# Altium project Volumemixer.PrjPcb
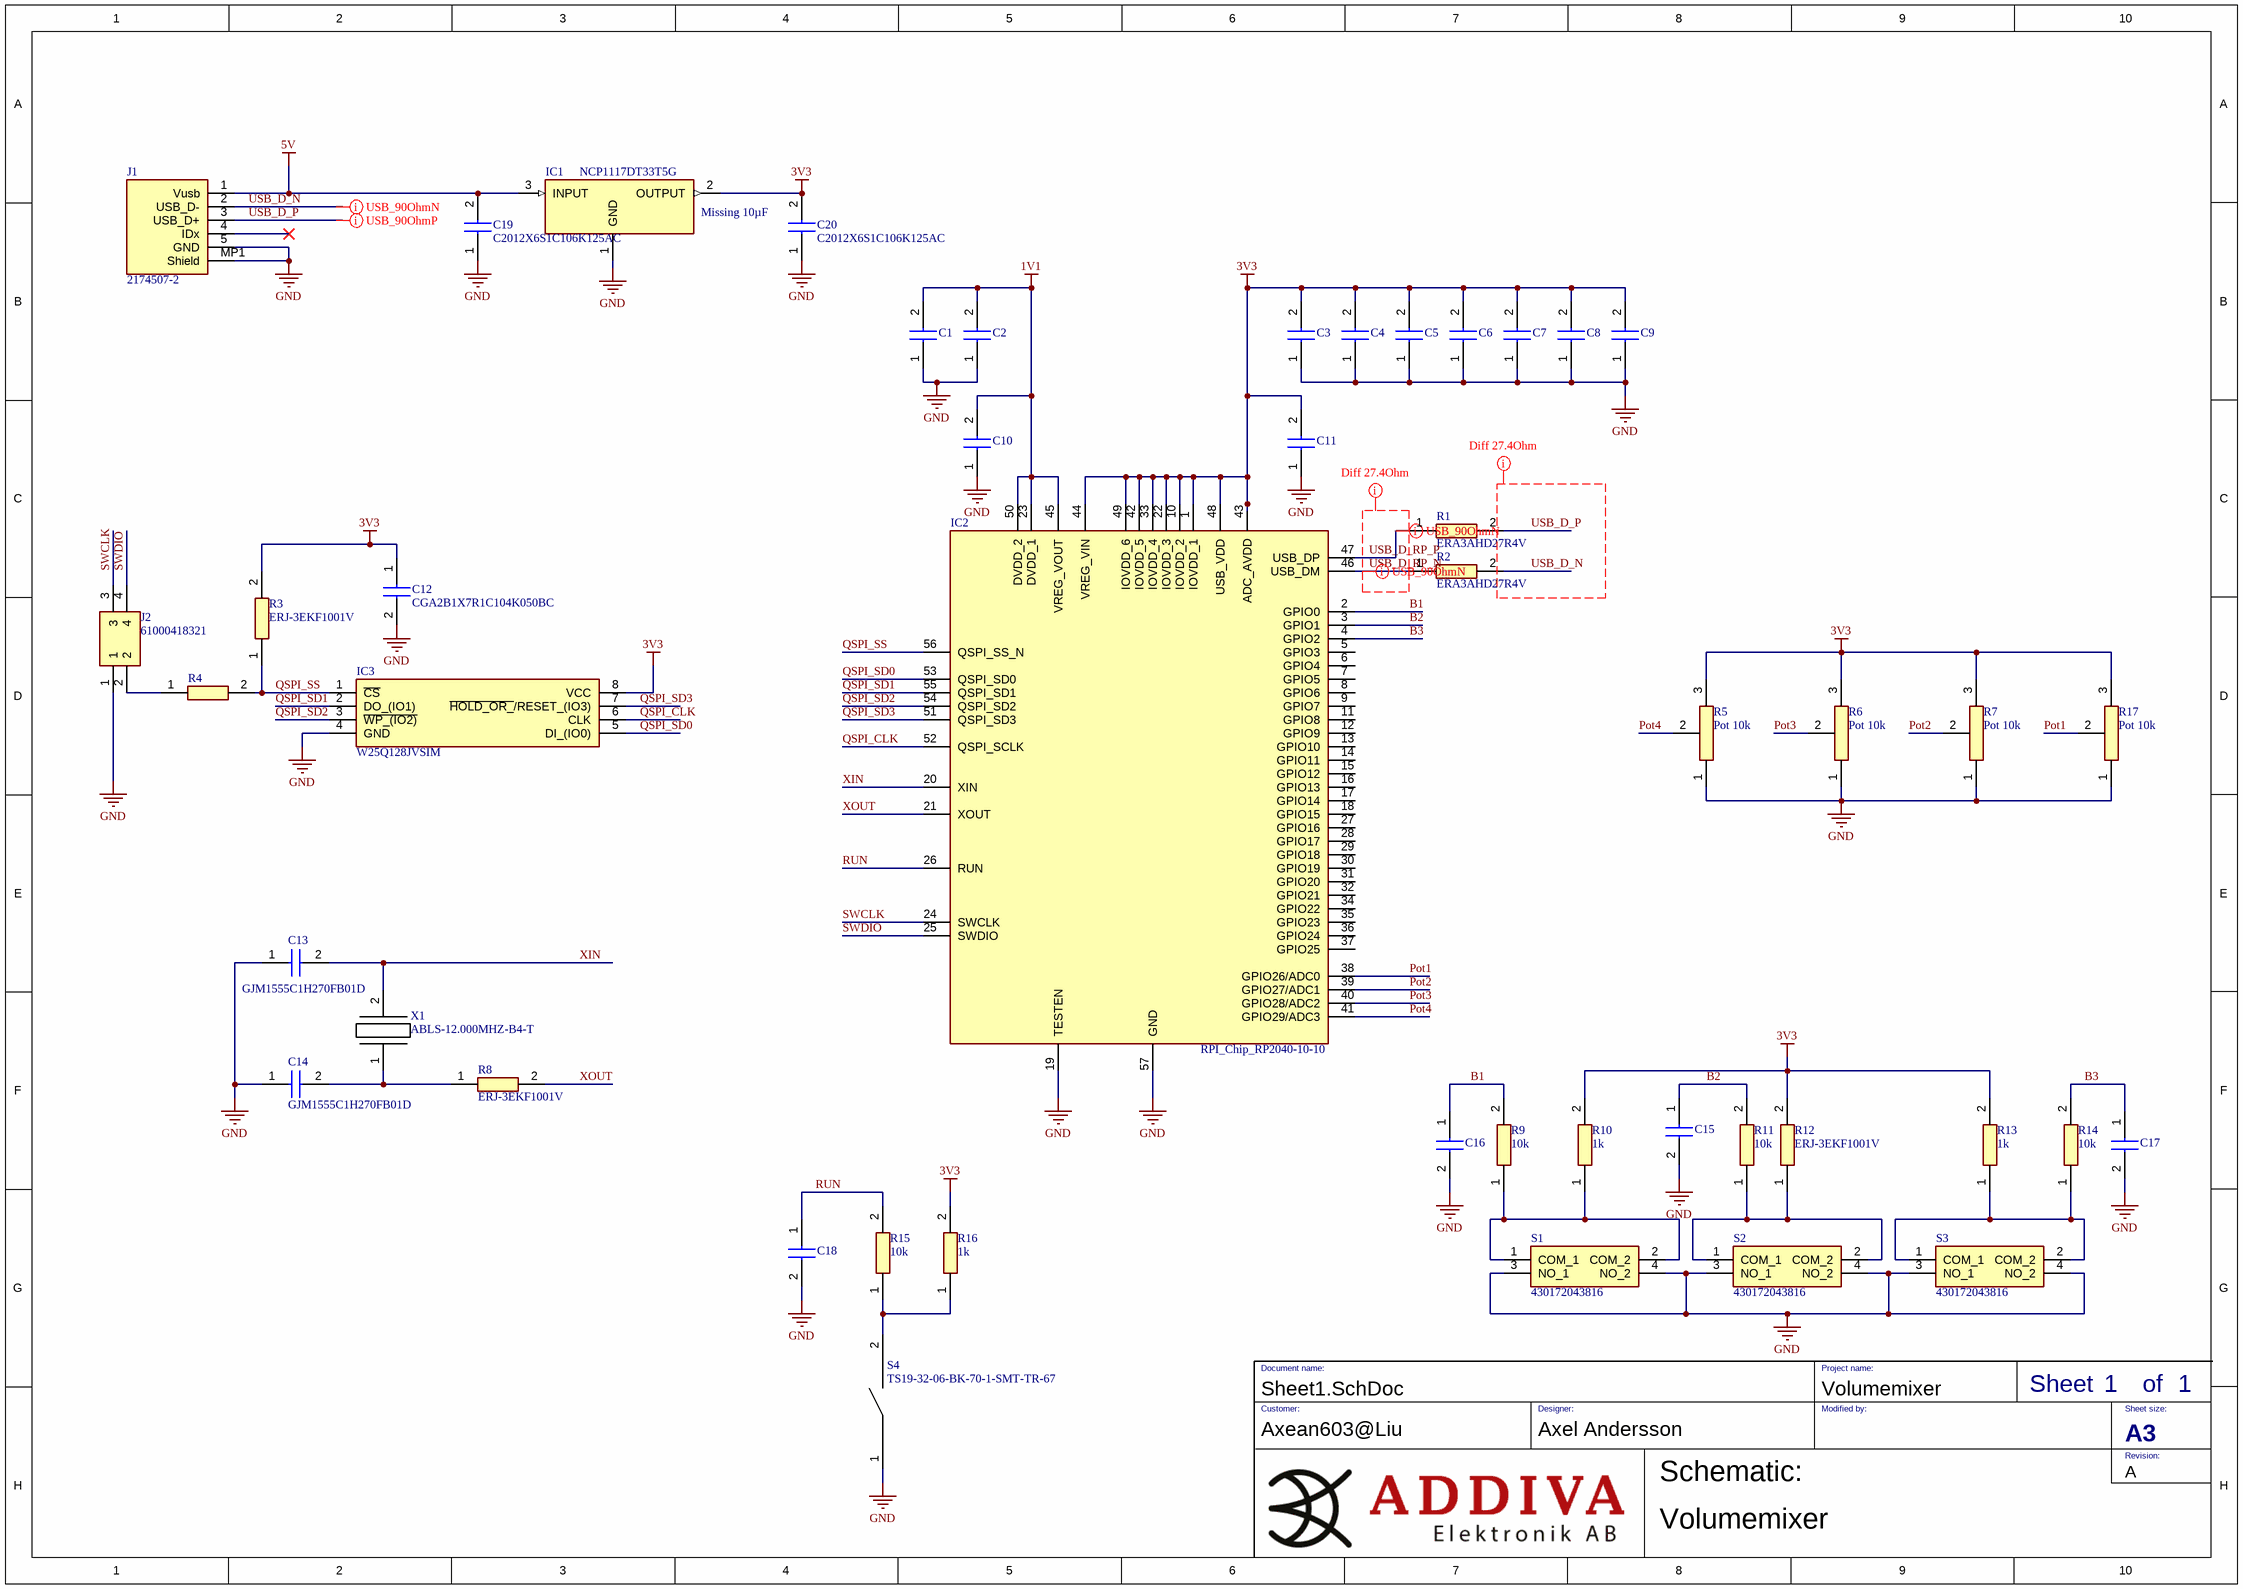
[diagram p0: Sheet1.SchDoc]
AE_Customer: Axean603@Liu; AE_Design: Volumemixer; AE_Designer: Axel Andersson; AE_ProjectName: Volumemixer; AE_revision: A
1 sheet, 47 parts. Net scope: global (net labels, ports and power ports of the same name join across sheets).
Board file: PCB.PcbDoc

## Sheet Sheet1.SchDoc
size 420 x 297 mm; SheetNumber: 1; SheetTotal: 1

### Parts
C1  CGA2B1X7R1C104K050BC  [CAPC1005X55N]  (value not drawn)
C2  CGA2B1X7R1C104K050BC  [CAPC1005X55N]  (value not drawn)
C3  CGA2B1X7R1C104K050BC  [CAPC1005X55N]  (value not drawn)
C4  CGA2B1X7R1C104K050BC  [CAPC1005X55N]  (value not drawn)
C5  CGA2B1X7R1C104K050BC  [CAPC1005X55N]  (value not drawn)
C6  CGA2B1X7R1C104K050BC  [CAPC1005X55N]  (value not drawn)
C7  CGA2B1X7R1C104K050BC  [CAPC1005X55N]  (value not drawn)
C8  CGA2B1X7R1C104K050BC  [CAPC1005X55N]  (value not drawn)
C9  CGA2B1X7R1C104K050BC  [CAPC1005X55N]  (value not drawn)
C10  C1005X6S1C105K050BC  [C1005_Commercial]  (value not drawn)
C11  C1005X6S1C105K050BC  [C1005_Commercial]  (value not drawn)
C12  CGA2B1X7R1C104K050BC  [CAPC1005X55N]
C13  GJM1555C1H270FB01D  [CAPC1005X55N]
C14  GJM1555C1H270FB01D  [CAPC1005X55N]
C15  C0402C105K9PAC  [CAPC1005X55N]  (value not drawn)
C16  C0402C105K9PAC  [CAPC1005X55N]  (value not drawn)
C17  C0402C105K9PAC  [CAPC1005X55N]  (value not drawn)
C18  C0402C105K9PAC  [CAPC1005X55N]  (value not drawn)
C19  C2012X6S1C106K125AC  [C2012_Commercial]
C20  C2012X6S1C106K125AC  [C2012_Commercial]
IC1  NCP1117DT33T5G  [TO229P990X238-4N]
IC2  RPI_Chip_RP2040-10-10  [QFN40P700X700X90-57N-D]
IC3  W25Q128JVSIM  [SOIC127P790X216-8N]
J1  2174507-2  [21745072]
J2  61000418321  [HUSRSP4W64P254_1016X254X854P]
R1  ERA3AHD27R4V  [ERA3A_(0603)]
R2  ERA3AHD27R4V  [ERA3A_(0603)]
R3  ERJ-3EKF1001V  [ERJ3EK_(0603)]
R4  ERJ-3EKF1001V  [ERJ3EK_(0603)]  (value not drawn)
R5  Pot 10k  [P0915NFC15BR10K]
R6  Pot 10k  [P0915NFC15BR10K]
R7  Pot 10k  [P0915NFC15BR10K]
R8  ERJ-3EKF1001V  [ERJ3EK_(0603)]
R9  10k  [ERJ3EK_(0603)]
R10  1k  [ERJ3EK_(0603)]
R11  10k  [ERJ3EK_(0603)]
R12  ERJ-3EKF1001V  [ERJ3EK_(0603)]
R13  1k  [ERJ3EK_(0603)]
R14  10k  [ERJ3EK_(0603)]
R15  10k  [ERJ3EK_(0603)]
R16  1k  [ERJ3EK_(0603)]
R17  Pot 10k  [P0915NFC15BR10K]
S1  430172043816  [430172043816]
S2  430172043816  [430172043816]
S3  430172043816  [430172043816]
S4  TS19-32-06-BK-70-1-SMT-TR-67  [TS193206BK701SMTTR67]
X1  ABLS-12.000MHZ-B4-T  [HC/49US-(AT49)_1]

### Nets
1V1: C1.2 C2.2 C10.2 IC2.23(DVDD_1) IC2.45(VREG_VOUT) IC2.50(DVDD_2)
3V3: C3.2 C4.2 C5.2 C6.2 C7.2 C8.2 C9.2 C11.2 C12.1 C20.2 IC1.2(OUTPUT) IC2.1(IOVDD_1) IC2.10(IOVDD_2) IC2.22(IOVDD_3) IC2.33(IOVDD_4) IC2.42(IOVDD_5) IC2.43(ADC_AVDD) IC2.44(VREG_VIN) IC2.48(USB_VDD) IC2.49(IOVDD_6) IC3.8(VCC) R3.2 R5.3 R6.3 R7.3 R10.2 R12.2 R13.2 R16.2 R17.3
5V: C19.2 IC1.3(INPUT) J1.1(Vusb)
GND: C1.1 C2.1 C3.1 C4.1 C5.1 C6.1 C7.1 C8.1 C9.1 C10.1 C11.1 C12.2 C13.1 C14.1 C15.2 C16.2 C17.2 C18.2 C19.1 C20.1 IC1.1(GND) IC2.19(TESTEN) IC2.57(GND) IC3.4(GND) J1.5(GND) J1.MP1(Shield) J2.1 R5.1 R6.1 R7.1 R17.1 S1.3(NO_1) S1.4(NO_2) S2.3(NO_1) S2.4(NO_2) S3.3(NO_1) S3.4(NO_2) S4.1
B1: C16.1 IC2.2(GPIO0) R9.2
B2: C15.1 IC2.3(GPIO1) R11.2
B3: C17.1 IC2.4(GPIO2) R14.2
Pot1: IC2.38(GPIO26/ADC0) R17.2
Pot2: IC2.39(GPIO27/ADC1) R7.2
Pot3: IC2.40(GPIO28/ADC2) R6.2
Pot4: IC2.41(GPIO29/ADC3) R5.2
QSPI_CLK: IC2.52(QSPI_SCLK) IC3.6(CLK)
QSPI_SD0: IC2.53(QSPI_SD0) IC3.5(DI_(IO0))
QSPI_SD1: IC2.55(QSPI_SD1) IC3.2(DO_(IO1))
QSPI_SD2: IC2.54(QSPI_SD2) IC3.3(~{WP_(IO2)})
QSPI_SD3: IC2.51(QSPI_SD3) IC3.7(~{HOLD_OR_}/RESET_(IO3))
QSPI_SS: IC2.56(QSPI_SS_N) IC3.1(~{CS}) R3.1 R4.2
RUN: C18.1 IC2.26(RUN) R15.2
SWCLK: IC2.24(SWCLK) J2.3
SWDIO: IC2.25(SWDIO) J2.4
USB_D_N: J1.2(USB_D-) R2.2
USB_D_P: J1.3(USB_D+) R1.2
USB_D_RP_N: IC2.46(USB_DM) R2.1
USB_D_RP_P: IC2.47(USB_DP) R1.1
XIN: C13.2 IC2.20(XIN) X1.2
XOUT: IC2.21(XOUT) R8.2
NetC14_2: C14.2 R8.1 X1.1
NetJ2_2: J2.2 R4.1
NetR9_1: R9.1 R10.1 S1.1(COM_1) S1.2(COM_2)
NetR11_1: R11.1 R12.1 S2.1(COM_1) S2.2(COM_2)
NetR13_1: R13.1 R14.1 S3.1(COM_1) S3.2(COM_2)
NetR15_1: R15.1 R16.1 S4.2

Not connected (* = marked no-connect by the designer): IC2 5(GPIO3) 6(GPIO4) 7(GPIO5) 8(GPIO6) 9(GPIO7) 11(GPIO8) 12(GPIO9) 13(GPIO10) 14(GPIO11) 15(GPIO12) 16(GPIO13) 17(GPIO14) 18(GPIO15) 27(GPIO16) 28(GPIO17) 29(GPIO18) 30(GPIO19) 31(GPIO20) 32(GPIO21) 34(GPIO22) 35(GPIO23) 36(GPIO24) 37(GPIO25); J1 4(IDx)*

### Layout directives
net class Diff USB: USB_D_N, USB_D_P, USB_D_RP_N, USB_D_RP_P
differential pair; differential pair class USB90Ohm: USB_D_N, USB_D_P, USB_D_RP_N, USB_D_RP_P

### Notes on the sheet
- (near IC1) Missing 10µF
- Document name:
- Project name:
- Sheet       of
- Customer:
- Designer:
- Modified by:
- A3
- Revision:
- Sheet size:
- Schematic:

### Library data of the parts
C1-C9 C12 = CGA2B1X7R1C104K050BC: Capacitor 100nF 16V; Manufacturer_Name: TDK; Datasheet Link: https://product.tdk.com/system/files/dam/doc/product/capacitor/ceramic/mlcc/catalog/mlcc_automotive_general_en.pdf; Height: 0.55mm; Manufacturer_Part_Number: CGA2B1X7R1C104K050BC; Mouser Part Number: 810-CGA2B1X7R1C104K; Mouser Price/Stock: https://www.mouser.co.uk/ProductDetail/TDK/CGA2B1X7R1C104K050BC?qs=NRhsANhppD8tgIeNjgC%2Fqg%3D%3D; Arrow Part Number: CGA2B1X7R1C104K050BC; Arrow Price/Stock: https://www.arrow.com/en/products/cga2b1x7r1c104k050bc/tdk?region=nac
C10 C11 = C1005X6S1C105K050BC: Capacitor 0402 1µF 16V; Manufacturer_Name: TDK; Datasheet Link: https://product.tdk.com/system/files/dam/doc/product/capacitor/ceramic/mlcc/catalog/mlcc_commercial_general_en.pdf; Height: 0.55mm; Manufacturer_Part_Number: C1005X6S1C105K050BC; Mouser Part Number: 810-C1005X6S1C105K; Mouser Price/Stock: https://www.mouser.co.uk/ProductDetail/TDK/C1005X6S1C105K050BC?qs=dfay7wIA1uGWVKHpqb9RWw%3D%3D; Arrow Part Number: C1005X6S1C105K050BC; Arrow Price/Stock: https://www.arrow.com/en/products/c1005x6s1c105k050bc/tdk?region=nac
C13 C14 = GJM1555C1H270FB01D: Capacitor 27pF 50V; Manufacturer_Name: Murata Electronics; Datasheet Link: https://psearch.en.murata.com/capacitor/product/GJM1555C1H270FB01%23.html; Height: 0.55mm; Manufacturer_Part_Number: GJM1555C1H270FB01D; Mouser Part Number: 81-GJM1555C1H270FB1D; Mouser Price/Stock: https://www.mouser.co.uk/ProductDetail/Murata-Electronics/GJM1555C1H270FB01D?qs=ui%252B2d9lVEI5sysymhzLg%252Bw%3D%3D; Arrow Part Number: GJM1555C1H270FB01D; Arrow Price/Stock: https://www.arrow.com/en/products/gjm1555c1h270fb01d/murata-manufacturing?region=nac
C15-C18 = C0402C105K9PAC: Capacitor 1µF 6V3 0402; Manufacturer_Name: KEMET; Datasheet Link: https://content.kemet.com/datasheets/KEM_C1002_X7R_SMD.pdf; Height: 0.55mm; Manufacturer_Part_Number: C0402C105K9PAC; Mouser Part Number: 80-C0402C105K9PAC; Mouser Price/Stock: https://www.mouser.co.uk/ProductDetail/KEMET/C0402C105K9PAC?qs=AHS6Mz2dKxPyNrxaU50ZkQ%3D%3D; Arrow Part Number: C0402C105K9PAC; Arrow Price/Stock: https://www.arrow.com/en/products/c0402c105k9pac/kemet-corporation?region=nac
C19 C20 = C2012X6S1C106K125AC: Capacitor 10µF 16V 0805; Manufacturer_Name: TDK; Datasheet Link: https://product.tdk.com/system/files/dam/doc/product/capacitor/ceramic/mlcc/catalog/mlcc_commercial_general_en.pdf; Height: 0.75mm; Manufacturer_Part_Number: C2012X6S1C106K125AC; Mouser Part Number: 810-C2012X6S1C106K1C; Mouser Price/Stock: https://www.mouser.co.uk/ProductDetail/TDK/C2012X6S1C106K125AC?qs=QN15moyvde8Kow3LarSCcA%3D%3D; Arrow Part Number: C2012X6S1C106K125AC; Arrow Price/Stock: https://www.arrow.com/en/products/c2012x6s1c106k125ac/tdk
IC1 = NCP1117DT33T5G: LDO 3V3 out; Manufacturer_Name: onsemi; Datasheet Link: http://www.onsemi.com/pub/Collateral/NCP1117-D.PDF; Height: 2.38mm; Manufacturer_Part_Number: NCP1117DT33T5G; Mouser Part Number: 863-NCP1117DT33T5G; Mouser Price/Stock: https://www.mouser.co.uk/ProductDetail/onsemi/NCP1117DT33T5G?qs=Gev%252BmEvV0ibY9yFNc3ZYyw%3D%3D; Arrow Part Number: NCP1117DT33T5G; Arrow Price/Stock: https://www.arrow.com/en/products/ncp1117dt33t5g/on-semiconductor?region=nac
IC2 = RPI_Chip_RP2040-10-10: RP2040 MCU; Manufacturer_Name: RASPBERRY-PI; Manufacturer_Part_Number: RPI Chip RP2040-10-10; Datasheet Link: https://datasheets.raspberrypi.com/rp2040/rp2040-datasheet.pdf; Height: 0.9mm; Mouser Part Number: 358-RP2040CHIP-10-10; Mouser Price/Stock: https://www.mouser.co.uk/ProductDetail/Raspberry-Pi/RPI-Chip-RP2040-10-10?qs=QNEnbhJQKva2vG4DZ5VuhA%3D%3D
IC3 = W25Q128JVSIM: 128 SPI Nor flash; Manufacturer_Name: Winbond; Datasheet Link: https://www.winbond.com/hq/search-resource-file.jsp?partNo=W25Q128JVSIM&type=datasheet; Height: 2.16mm; Manufacturer_Part_Number: W25Q128JVSIM; Mouser Part Number: 454-W25Q128JVSIM; Mouser Price/Stock: https://www.mouser.co.uk/ProductDetail/Winbond/W25Q128JVSIM?qs=qSfuJ%252Bfl%2Fd6d7A5WLggp6w%3D%3D; Arrow Part Number: W25Q128JVSIM; Arrow Price/Stock: https://www.arrow.com/en/products/w25q128jvsim/winbond-electronics?region=nac
J1 = 2174507-2: Micro USB Connector; Manufacturer_Name: TE Connectivity; Datasheet Link: https://componentsearchengine.com/Datasheets/1/2174507-2.pdf; Height: 2.86mm; Manufacturer_Part_Number: 2174507-2; Mouser Part Number: 571-2174507-2; Mouser Price/Stock: https://www.mouser.co.uk/ProductDetail/TE-Connectivity/2174507-2?qs=kAqyOuzYGe%252BUWCFD1qNBLQ%3D%3D; Arrow Part Number: 2174507-2; Arrow Price/Stock: https://www.arrow.com/en/products/2174507-2/te-connectivity?region=nac
J2 = 61000418321: Connector; Manufacturer_Name: Wurth Elektronik; Datasheet Link: https://www.we-online.com/catalog/datasheet/61000418321.pdf; Manufacturer_Part_Number: 61000418321
R1 R2 = ERA3AHD27R4V: Resistor 0603 27.4Ohm; Manufacturer_Name: Panasonic; Datasheet Link: http://industrial.panasonic.com/cdbs/www-data/pdf/RDM0000/AOA0000C307.pdf; Height: 0.5mm; Manufacturer_Part_Number: ERA3AHD27R4V
R3 R4 R8 R10 R12 R13 R16 = ERJ-3EKF1001V: Resistor 1k 0603; Manufacturer_Name: Panasonic; Datasheet Link: https://industrial.panasonic.com/cdbs/www-data/pdf/RDA0000/AOA0000C304.pdf; Height: 0.55mm; Manufacturer_Part_Number: ERJ-3EKF1001V; Mouser Part Number: 667-ERJ-3EKF1001V; Mouser Price/Stock: https://www.mouser.co.uk/ProductDetail/Panasonic/ERJ-3EKF1001V?qs=H7k1u0Mp9JTM8yQxOuvoDg%3D%3D; Arrow Part Number: ERJ-3EKF1001V; Arrow Price/Stock: https://www.arrow.com/en/products/erj-3ekf1001v/panasonic?region=nac
R5-R7 R17 = P0915N-FC15BR10K: Manufacturer_Name: TT Electronics; Datasheet Link: https://datasheet.datasheetarchive.com/originals/distributors/Datasheets_SAMA/b6f9aacdbf7d1767bdcee7cb40d23820.pdf; Height: 11mm; Manufacturer_Part_Number: P0915N-FC15BR10K; Mouser Part Number: 858-P0915N-FC15BR10K; Mouser Price/Stock: https://www.mouser.com/Search/Refine.aspx?Keyword=858-P0915N-FC15BR10K; Arrow Part Number: P0915N-FC15BR10K; Arrow Price/Stock: https://www.arrow.com/en/products/p0915n-fc15br10k/bi-technologies?region=nac
R9 R11 R14 R15 = ERJ-3EKF1001V: Resistor 10k 0603; Manufacturer_Name: Panasonic; Datasheet Link: https://industrial.panasonic.com/cdbs/www-data/pdf/RDA0000/AOA0000C304.pdf; Height: 0.55mm; Manufacturer_Part_Number: ERJ-3EKF1001V; Mouser Part Number: 667-ERJ-3EKF1001V; Mouser Price/Stock: https://www.mouser.co.uk/ProductDetail/Panasonic/ERJ-3EKF1001V?qs=H7k1u0Mp9JTM8yQxOuvoDg%3D%3D; Arrow Part Number: ERJ-3EKF1001V; Arrow Price/Stock: https://www.arrow.com/en/products/erj-3ekf1001v/panasonic?region=nac
S1-S3 = 430172043816: Switch; Manufacturer_Name: Wurth Elektronik; Datasheet Link: https://www.we-online.com/catalog/datasheet/430172043816.pdf; Height: 4.3mm; Manufacturer_Part_Number: 430172043816; Mouser Part Number: 710-430172043816; Mouser Price/Stock: https://www.mouser.co.uk/ProductDetail/Wurth-Elektronik/430172043816?qs=sPbYRqrBIVkS9EzfxGfqQA%3D%3D
S4 = TS19-32-06-BK-70-1-SMT-TR-67: Switch; Manufacturer_Name: CUI Inc.; Datasheet Link: https://www.cuidevices.com/product/resource/ts19.pdf; Height: 0.65mm; Manufacturer_Part_Number: TS19-32-06-BK-70-1-SMT-TR-67; Mouser Part Number: 179-TS193206BK701SM; Mouser Price/Stock: https://www.mouser.co.uk/ProductDetail/CUI-Devices/TS19-32-06-BK-70-1-SMT-TR-67?qs=tlsG%2FOw5FFj0aJkgA5InKg%3D%3D
X1 = ABLS-12.000MHZ-B4-T: Crystal oscillator; Manufacturer_Name: ABRACON; Datasheet Link: https://componentsearchengine.com/Datasheets/2/ABLS-12.000MHZ-B4-T.pdf; Manufacturer_Part_Number: ABLS-12.000MHZ-B4-T; Mouser Part Number: 815-ABLS-12.0M-T; Mouser Price/Stock: https://www.mouser.co.uk/ProductDetail/ABRACON/ABLS-12.000MHZ-B4-T?qs=yTU0IcKoRlGSQ8ooxPPVnQ%3D%3D; Arrow Part Number: ABLS-12.000MHZ-B4-T; Arrow Price/Stock: https://www.arrow.com/en/products/abls-12.000mhz-b4-t/abracon?region=nac